# EAGLE design BusPirate-v5.0-SSOP (EAGLE 7.6.0)
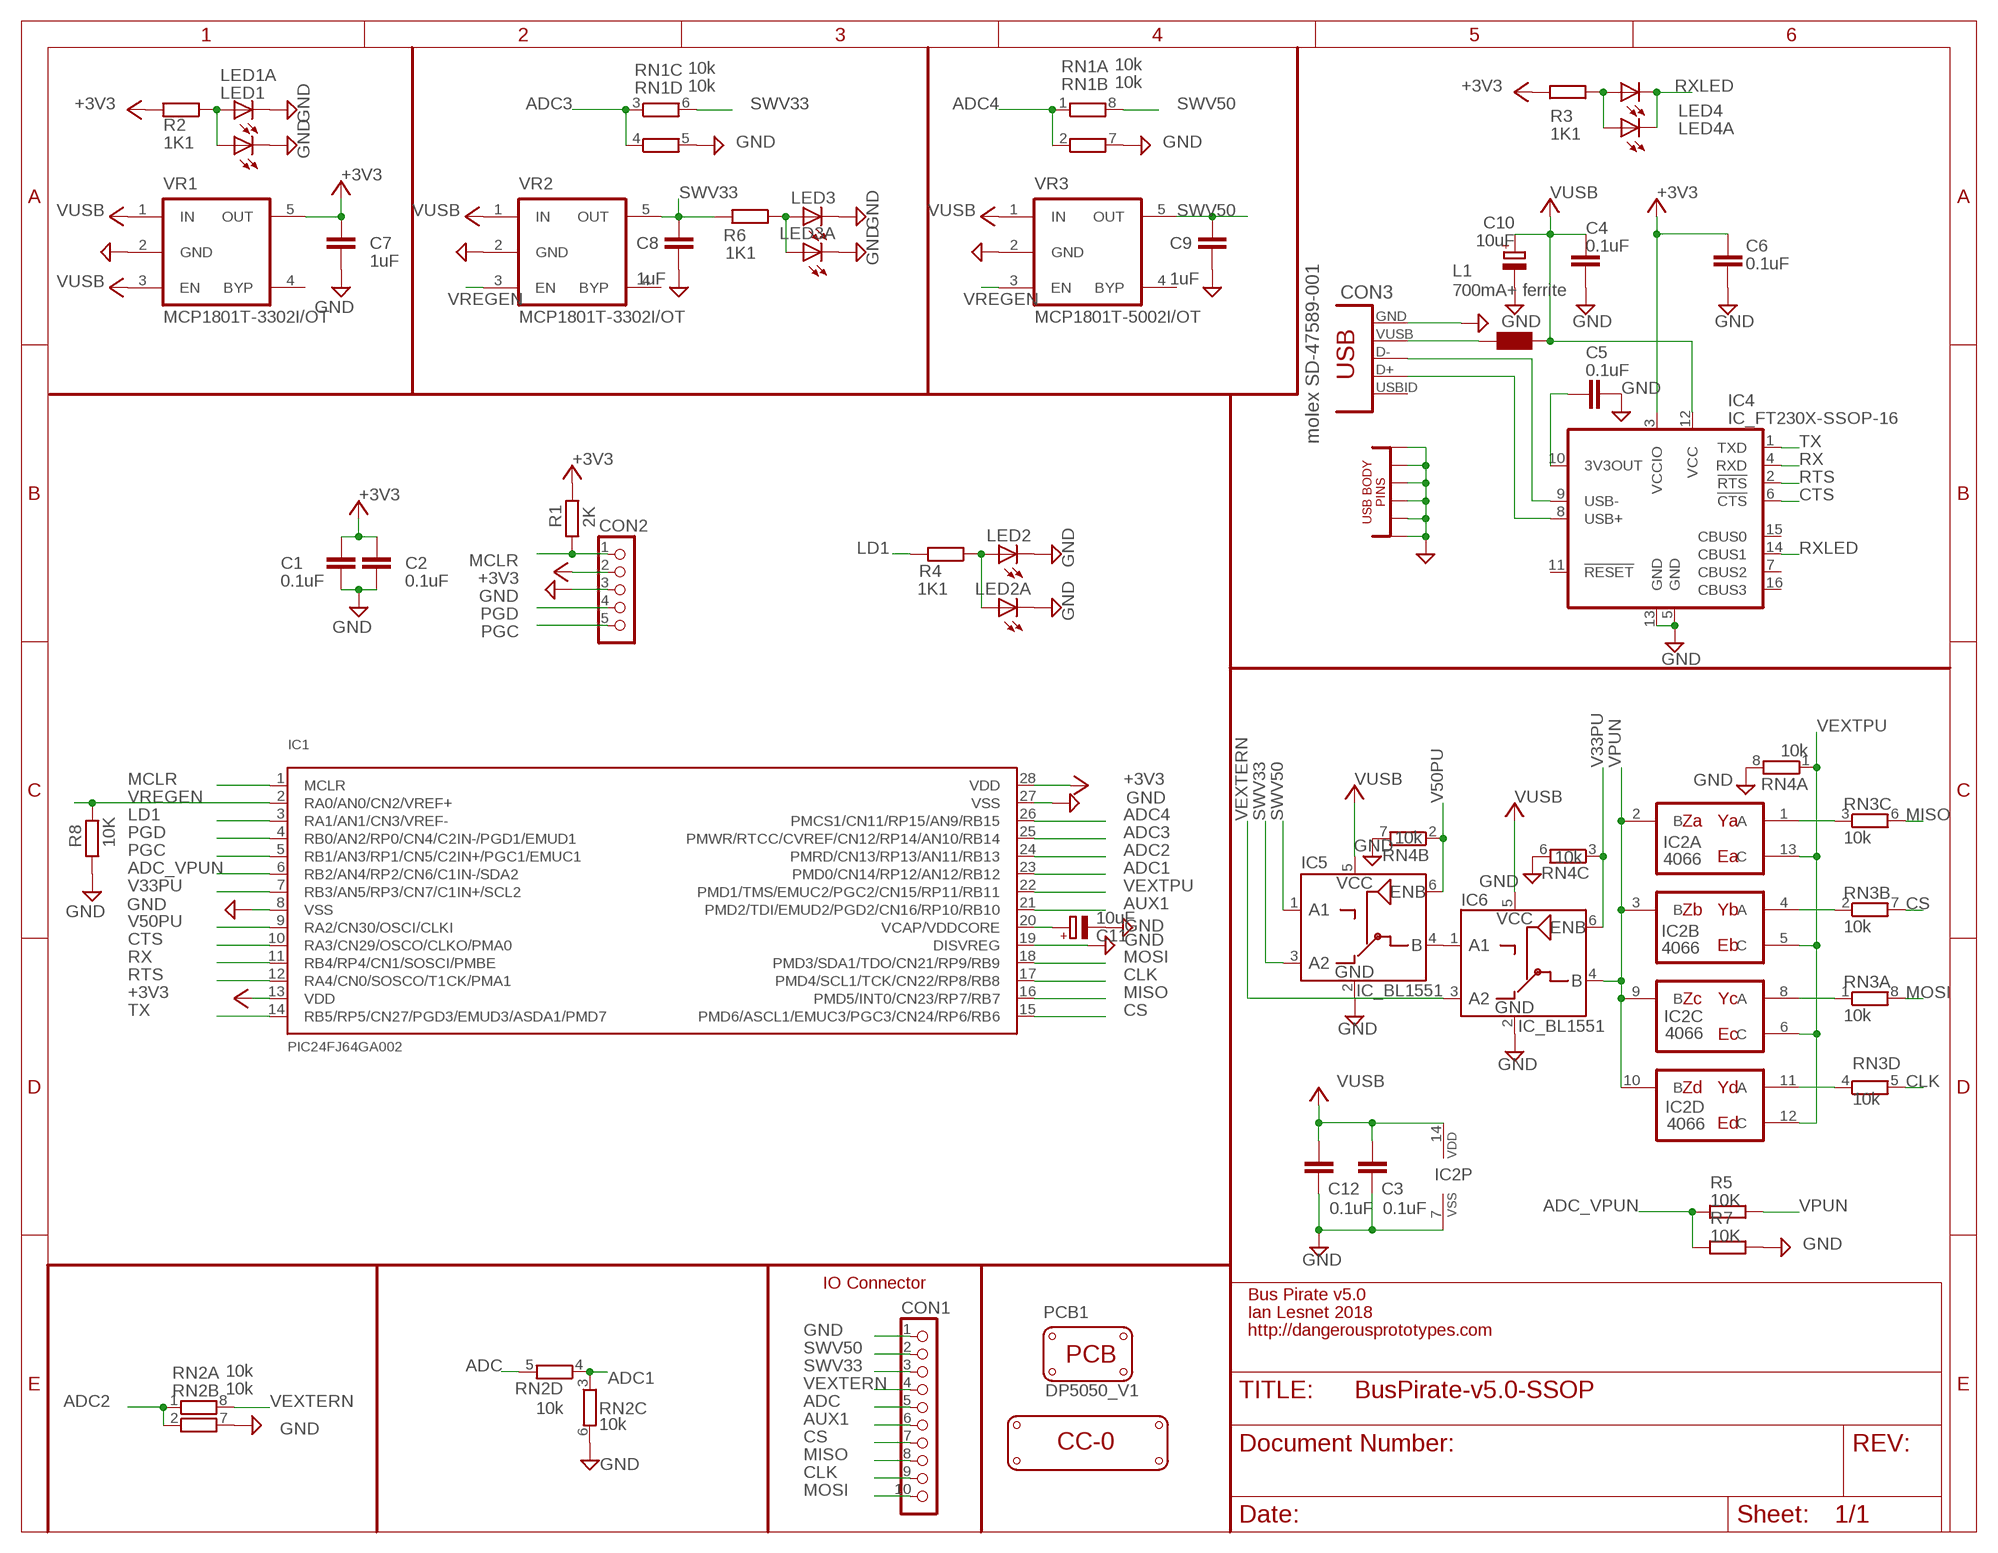
[diagram p0: schematic, sheet 1]

## Parts
C1  0.1uF  CAPC603  [C603]
C2  0.1uF  CAPC603  [C603]
C3  0.1uF  CAPC603  [C603]
C4  0.1uF  CAPC603  [C603]
C5  0.1uF  CAPC603  [C603]
C6  0.1uF  CAPC603  [C603]
C7  1uF  CAPC603  [C603]
C8  1uF  CAPC603  [C603]
C9  1uF  CAPC603  [C603]
C10  10uF  CPOL-EUSMCA  [SMC_A]
C11  10uF  CPOL-EUSMCA  [SMC_A]
C12  0.1uF  CAPC603  [C603]
CON1  CON_HEADER_1X10-RIGHT_ANGLED_PTH_SHROUDED  [M1X10_MALE_RIGHT_ANGLES_PTH_SHROUDED]
CON2  CON_HEADER_1X05-PTH  [M1X5]
CON3  molex SD-47589-001  CON-USB-F-MICRO-B-2  [CON_USB_MICRO-B-2-SD-47589-001]
IC1  PIC24FJ64GA002  [SSOP28]
IC2  4066  [TSSOP14]
IC4  IC_FT230X-SSOP-16  [SSOP-16-FTDI]
IC5  IC_BL1551  [SC-70-6]
IC6  IC_BL1551  [SC-70-6]
L1  700mA+ ferrite  WE-KIL_0805  [WE-KI_0805_B]
LED1  LED-0805  [LED-805]
LED1A  LED-0805  [LED-805]
LED2  LED-0805  [LED-805]
LED2A  LED-0805  [LED-805]
LED3  LED-0805  [LED-805]
LED3A  LED-0805  [LED-805]
LED4  LED-0805  [LED-805]
LED4A  LED-0805  [LED-805]
LOGO1  LOGO_CC-0  [LOGO_CC-0]
PCB1  PCB_DP_SQUARE-5X5  [DP5050_V1]
R1  2K  RESISTORR603  [R603]
R2  1K1  RESISTORR603  [R603]
R3  1K1  RESISTORR603  [R603]
R4  1K1  RESISTORR603  [R603]
R5  10K  RESISTORR603  [R603]
R6  1K1  RESISTORR603  [R603]
R7  10K  RESISTORR603  [R603]
R8  10K  RESISTORR603  [R603]
RN1  10k  RNETWORK  [RN8P-4R-CRA06S]
RN2  10k  RNETWORK  [RN8P-4R-CRA06S]
RN3  10k  RNETWORK  [RN8P-4R-CRA06S]
RN4  10k  RNETWORK  [RN8P-4R-CRA06S]
VR1  MCP1801T-3302I/OT  MIC5205  [SOT-23-5]
VR2  MCP1801T-3302I/OT  MIC5205  [SOT-23-5]
VR3  MCP1801T-5002I/OT  MIC5205  [SOT-23-5]

## Nets
$N26: CON3.P1(VUSB) L1.2
+3V3: C1.1 C2.1 C6.1 C7.1 CON2.2 IC1.13(VDD) IC1.28(VDD) IC4.3(VCCIO) R1.2 R2.2 R3.2 VR1.5(OUT) ; supply symbol labelled SUPPLY_+3V3
ADC: CON1.5 RN2.5
ADC1: IC1.23(PMD0/CN14/RP12/AN12/RB12) RN2.3 RN2.4
ADC2: IC1.24(PMRD/CN13/RP13/AN11/RB13) RN2.1 RN2.2
ADC3: IC1.25(PMWR/RTCC/CVREF/CN12/RP14/AN10/RB14) RN1.3 RN1.4
ADC4: IC1.26(PMCS1/CN11/RP15/AN9/RB15) RN1.1 RN1.2
ADC_VPUN: IC1.6(RB2/AN4/RP2/CN6/C1IN-/SDA2) R5.2 R7.2
AUX1: CON1.6 IC1.21(PMD2/TDI/EMUD2/PGD2/CN16/RP10/RB10)
CLK: CON1.9 IC1.17(PMD4/SCL1/TCK/CN22/RP8/RB8) RN3.5
CS: CON1.7 IC1.15(PMD6/ASCL1/EMUC3/PGC3/CN24/RP6/RB6) RN3.7
CTS: IC1.10(RA3/CN29/OSCO/CLKO/PMA0) IC4.6(!CTS)
GND: C1.2 C2.2 C3.2 C4.2 C5.2 C6.2 C7.2 C8.2 C9.2 C10.- C11.- C12.2 CON1.1 CON2.3 CON3.BODY@1 CON3.BODY@2 CON3.BODY@3 CON3.BODY@4 CON3.BODY@5 CON3.BODY@6 CON3.BODY@7 CON3.BODY@8 CON3.BODY@9 CON3.BODY@10 CON3.P5(GND) IC1.8(VSS) IC1.19(DISVREG) IC1.27(VSS) IC2.7(P:VSS) IC4.5(GND) IC4.13(GND) IC5.2(GND) IC6.2(GND) LED1.C LED1A.C LED2.C LED2A.C LED3.C LED3A.C R7.1 R8.1 RN1.5 RN1.7 RN2.6 RN2.7 RN4.6 RN4.7 RN4.8 VR1.2(GND) VR2.2(GND) VR3.2(GND)
LD1: IC1.3(RA1/AN1/CN3/VREF-) R4.2
MCLR: CON2.1 IC1.1(MCLR) R1.1
MISO: CON1.8 IC1.16(PMD5/INT0/CN23/RP7/RB7) RN3.6
MOSI: CON1.10 IC1.18(PMD3/SDA1/TDO/CN21/RP9/RB9) RN3.8
N$1: IC2.11(D:A) RN3.4
N$2: IC2.8(C:A) RN3.1
N$3: C11.+ IC1.20(VCAP/VDDCORE)
N$4: IC2.4(B:A) RN3.2
N$5: IC2.1(A:A) RN3.3
N$6: LED2.A LED2A.A R4.1
N$7: LED1.A LED1A.A R2.1
N$8: C5.1 IC4.10(3V3OUT)
N$12: IC5.4(B) IC6.1(A1)
N$13: LED4.A LED4A.A R3.1
N$15: CON3.P3(D+) IC4.8(USB+)
N$16: CON3.P2(D-) IC4.9(USB-)
N$18: LED3.A LED3A.A R6.1
PGC: CON2.5 IC1.5(RB1/AN3/RP1/CN5/C2IN+/PGC1/EMUC1)
PGD: CON2.4 IC1.4(RB0/AN2/RP0/CN4/C2IN-/PGD1/EMUD1)
RTS: IC1.12(RA4/CN0/SOSCO/T1CK/PMA1) IC4.2(!RTS)
RX: IC1.11(RB4/RP4/CN1/SOSCI/PMBE) IC4.4(RXD)
RXLED: IC4.14(CBUS1) LED4.C LED4A.C
SWV33: C8.1 CON1.3 IC5.3(A2) R6.2 RN1.6 VR2.5(OUT)
SWV50: C9.1 CON1.2 IC5.1(A1) RN1.8 VR3.5(OUT)
TX: IC1.14(RB5/RP5/CN27/PGD3/EMUD3/ASDA1/PMD7) IC4.1(TXD)
V33PU: IC1.7(RB3/AN5/RP3/CN7/C1IN+/SCL2) IC6.6(ENB) RN4.3
V50PU: IC1.9(RA2/CN30/OSCI/CLKI) IC5.6(ENB) RN4.2
VEXTERN: CON1.4 IC6.3(A2) RN2.8
VEXTPU: IC1.22(PMD1/TMS/EMUC2/PGC2/CN15/RP11/RB11) IC2.5(B:C) IC2.6(C:C) IC2.12(D:C) IC2.13(A:C) RN4.1
VPUN: IC2.2(A:B) IC2.3(B:B) IC2.9(C:B) IC2.10(D:B) IC6.4(B) R5.1
VREGEN: IC1.2(RA0/AN0/CN2/VREF+) R8.2 VR2.3(EN) VR3.3(EN)
VUSB: C3.1 C4.1 C10.+ C12.1 IC2.14(P:VDD) IC4.12(VCC) IC5.5(VCC) IC6.5(VCC) L1.1 VR1.1(IN) VR1.3(EN) VR2.1(IN) VR3.1(IN) ; supply symbol labelled SUPPLY_VUSB
Unconnected: CON3.P4(USBID) IC4.7(CBUS2) IC4.11(!RESET) IC4.15(CBUS0) IC4.16(CBUS3) RN4.4 RN4.5 VR1.4(BYP) VR2.4(BYP) VR3.4(BYP)

## Notes on the sheet
- Za | Ya
- Ea
- Zb | Yb
- Eb
- Zc | Yc
- Ec
- Zd | Yd
- Ed
- IO Connector
- Bus Pirate v5.0
- Ian Lesnet 2018
- http://dangerousprototypes.com

## Library data of the parts
C1-C9 C12 = dp_devices:CAP
C10 C11 = rcl:CPOL-EU: POLARIZED CAPACITOR, European symbol
CON1 = dp_devices.v6:CON_HEADER_1X10
CON2 = dp_devices.v6:CON_HEADER_1X05
CON3 = dp_devices.v6:CON-USB-F-MICRO-B-2: Micro USB based on molex SD-47589-001
IC1 = dp_devices:PIC24FJ64GA002: 16-bit General Purpose Flash Microcontroller
IC2 = 40xx:4066: Quad bilateral ANALOG SWITCH
IC4 = dp_devices.v6:IC_FT230X: BASIC USB to UART IC
IC5 IC6 = dp_devices.v6:IC_BL1551: BL1551 Low Voltage SPDT Analog Switch
L1 = wuerth-elektronik:WE-KIL: SMD Wire Wound Ceramic Inductor WE-KIL - Low profile - High Q values -- Bluetooth -- Wireless LAN -- RF oscillation circuit -- IF impedance matching
LED1 LED1A LED2 LED2A LED3 LED3A LED4 LED4A = dp_devices.v6:LED: Light Emitting Diode
LOGO1 = dp_devices:LOGO_CC-0
PCB1 = dp_devices.v6:PCB_DP_SQUARE: Dangerous Prototypes Standard Square PCB sizes; PCB_SIZE: DP5050_V1
R1-R8 = dp_devices:RESISTOR
RN1-RN4 = dp_devices:RNETWORK: 4 Resistor Array 0603
VR1-VR3 = dp_devices:MIC5205: 150ma Low-Noise LDO Regulator

## Board
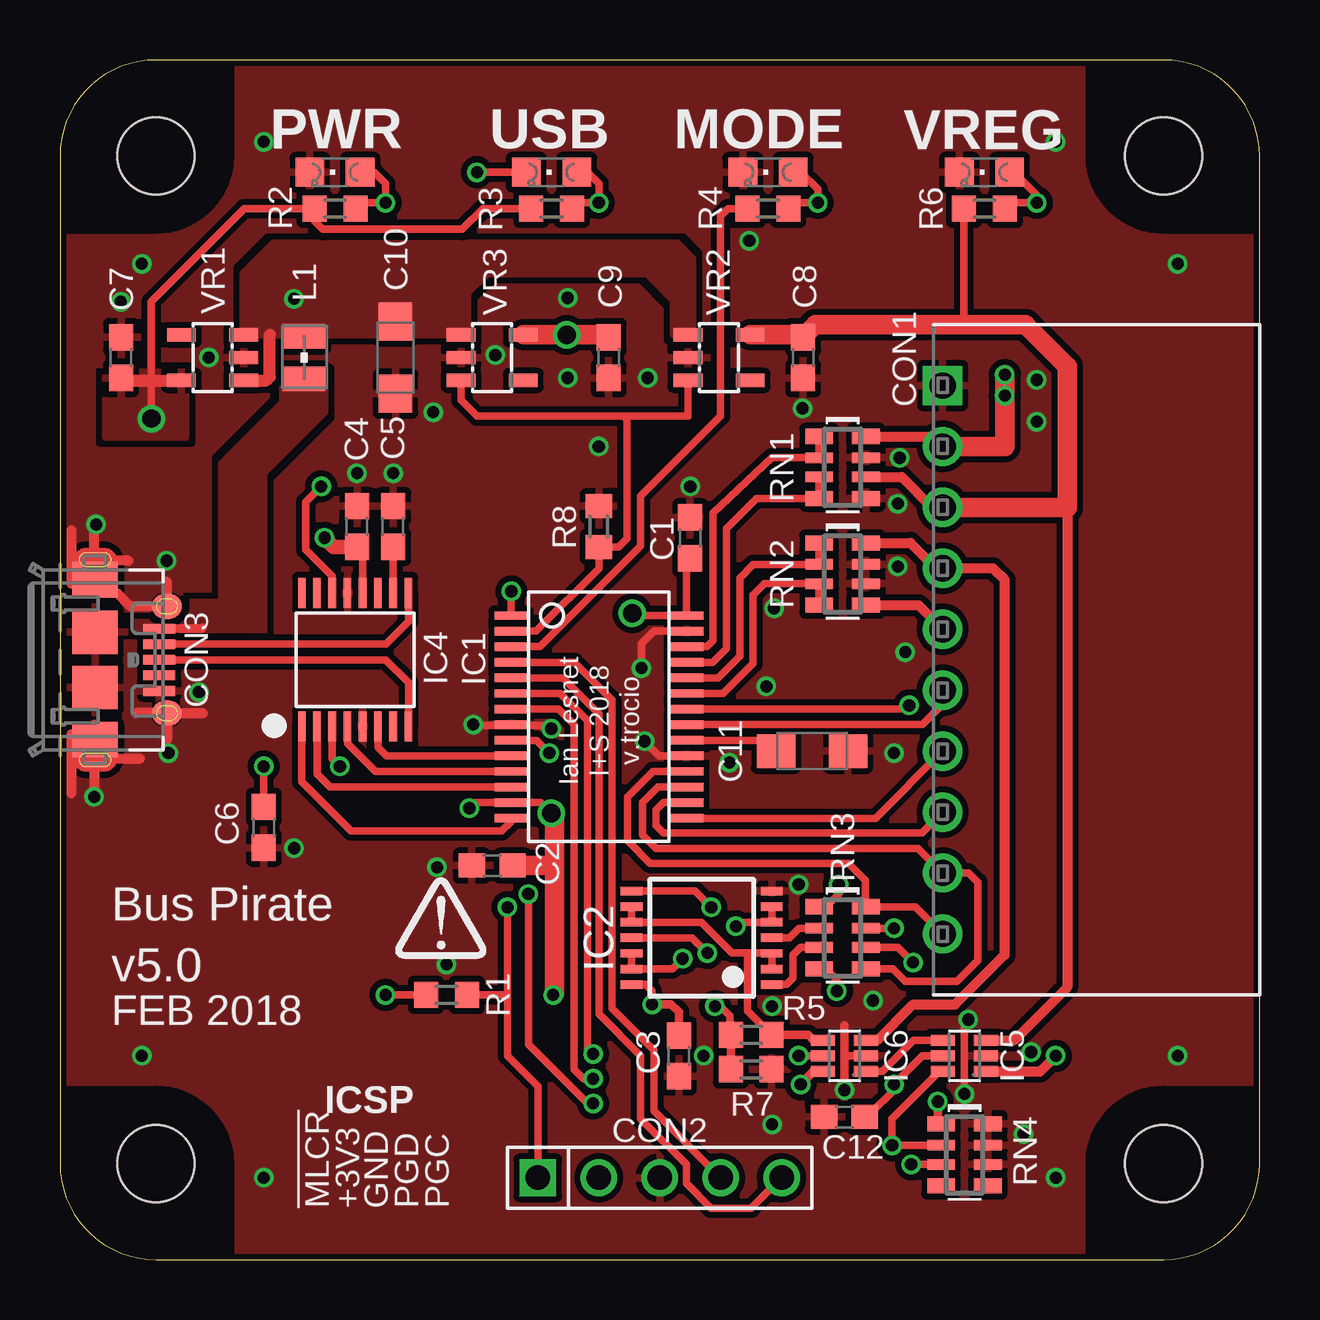
[diagram p1: board, top side]
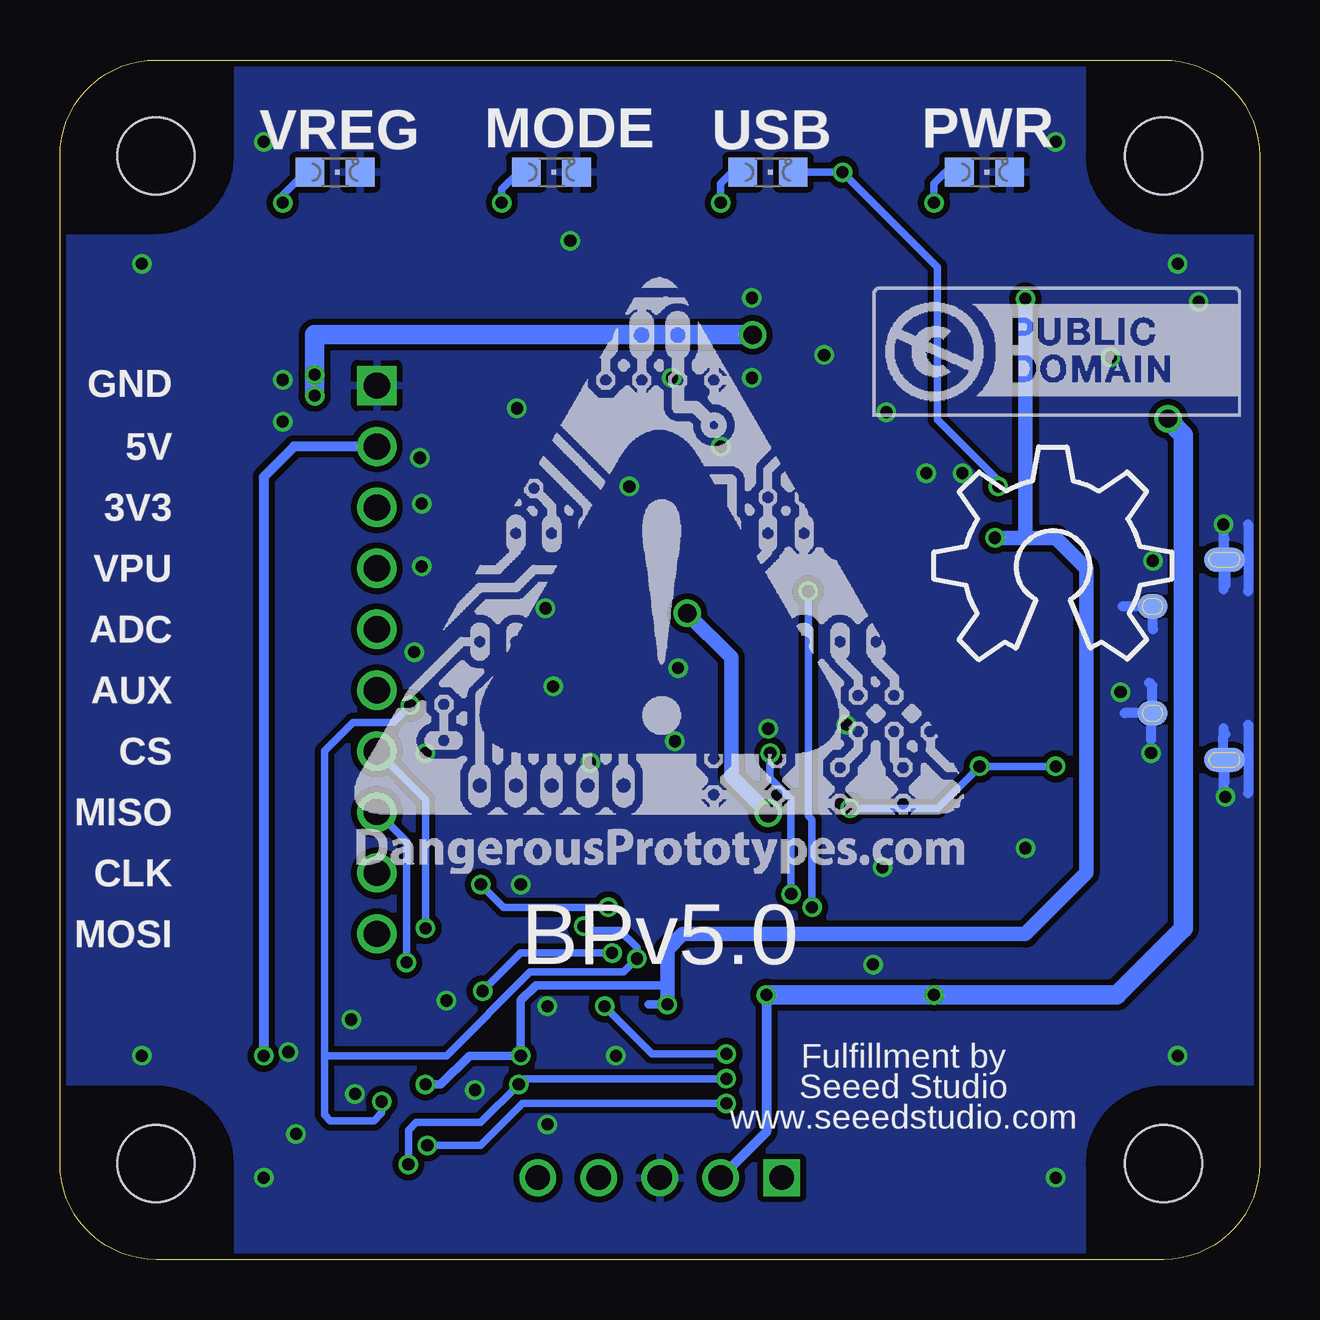
[diagram p2: board, bottom side, seen from below]

Size 50 x 50 mm. Coordinates in mm from the lower left corner, seen from the top.
Copper layers (1*16): Top 0.035mm / dielectric 1.5mm / Bottom 0.035mm
Design rules "dirt_cheap_dirty_boards.v1.1": minimum track width 6mil, minimum drill 12mil, track to track 6mil, track to pad 6mil, pad to pad 6mil, via to via 6mil, smd to smd 0mil, copper to edge 10mil, drill to drill 10mil, minimum pad ring 10mil, minimum via ring 6mil, stop-mask expansion 2mil, vias tented up to drill 25mil, thermal gap 10mil

### Footprints (pad centres in the part's own frame; a part is rotated, then mirrored left to right if it is on the bottom)
C603 = smd 1.1 x 1: 1 -0.85,0; 2 0.85,0
SMC_A = smd 1.6 x 1.4: + -1.5,0; - 1.5,0
M1X10_MALE_RIGHT_ANGLES_PTH_SHROUDED = drill 1.09 square: 1 -11.43,-6.415 | drill 1.09: 2 -8.89,-6.415; 3 -6.35,-6.415; 4 -3.81,-6.415; 5 -1.27,-6.415; 6 1.27,-6.415; 7 3.81,-6.415; 8 6.35,-6.415; 9 8.89,-6.415; 10 11.43,-6.415
M1X5 = drill 1.02 square: 1 -5.08,0 | drill 1.02: 2 -2.54,0; 3 0,0; 4 2.54,0; 5 5.08,0
CON_USB_MICRO-B-2-SD-47589-001 = smd 1.05 x 1.25: BODY@1 -2.225,3.35; BODY@3 2.225,3.35 | smd 1.05 x 1.25 bottom: BODY@2 -2.225,3.35; BODY@4 2.225,3.35 | smd 1.48 x 1.9: BODY@5 -3.338,0.35; BODY@9 3.338,0.35 | smd 1 x 1.7 bottom: BODY@6 -4.175,0.35; BODY@10 4.175,0.35 | smd 1.8 x 1.9: BODY@7 -1.15,0.35; BODY@8 1.15,0.35 | smd 0.4 x 1.35: P1 -1.3,3.025; P2 -0.65,3.025; P3 0,3.025; P4 0.65,3.025; P5 1.3,3.025
SSOP28 = smd 0.348 x 1.397: 1 -4.225,-3.656; 2 -3.575,-3.656; 3 -2.925,-3.656; 4 -2.275,-3.656; 5 -1.625,-3.656; 6 -0.975,-3.656; 7 -0.325,-3.656; 8 0.325,-3.656; 9 0.975,-3.656; 10 1.625,-3.656; 11 2.275,-3.656; 12 2.925,-3.656; 13 3.575,-3.656; 14 4.225,-3.656; 15 4.225,3.656; 16 3.575,3.656; 17 2.925,3.656; 18 2.275,3.656; 19 1.625,3.656; 20 0.975,3.656; 21 0.325,3.656; 22 -0.325,3.656; 23 -0.975,3.656; 24 -1.625,3.656; 25 -2.275,3.656; 26 -2.925,3.656; 27 -3.575,3.656; 28 -4.225,3.656
TSSOP14 = smd 0.35 x 0.9: 1 -1.95,-2.925; 2 -1.3,-2.925; 3 -0.65,-2.925; 4 0,-2.925; 5 0.65,-2.925; 6 1.3,-2.925; 7 1.95,-2.925; 8 1.95,2.925; 9 1.3,2.925; 10 0.65,2.925; 11 0,2.925; 12 -0.65,2.925; 13 -1.3,2.925; 14 -1.95,2.925
SSOP-16-FTDI = smd 0.32 x 1.26: 1 -2.223,-2.779; 2 -1.588,-2.779; 3 -0.953,-2.779; 4 -0.318,-2.779; 5 0.317,-2.779; 6 0.952,-2.779; 7 1.587,-2.779; 8 2.222,-2.779; 9 2.222,2.779; 10 1.587,2.779; 11 0.952,2.779; 12 0.317,2.779; 13 -0.318,2.779; 14 -0.953,2.779; 15 -1.588,2.779; 16 -2.223,2.779
SC-70-6 = smd 0.47 x 1: 1 -0.65,-0.9; 2 0,-0.9; 3 0.65,-0.9; 4 0.65,0.9; 5 0,0.9; 6 -0.65,0.9
WE-KI_0805_B = smd 1.02 x 1.78: 1 -0.89,0; 2 0.89,0
LED-805 = smd 1.2 x 1.2: A 0,-1.05; C 0,1.05
DP5050_V1 = hole 3.2: -21,-21; 21,-21; 21,21; -21,21
R603 = smd 1 x 1.1: 1 -0.85,0; 2 0.85,0
RN8P-4R-CRA06S = smd 0.63 x 1.15: 1 -1.295,-0.975; 4 1.295,-0.975; 5 1.295,0.975; 8 -1.295,0.975 | smd 0.44 x 1.15: 2 -0.4,-0.975; 3 0.4,-0.975; 6 0.4,0.975; 7 -0.4,0.975
SOT-23-5 = smd 0.55 x 1.2: 1 -0.95,-1.3; 2 0,-1.3; 3 0.95,-1.3; 4 0.95,1.3; 5 -0.95,1.3

### Placement (x,y rotation side)
C1  26.27,30.08 90 top
C2  18.02,16.42 180 top
C3  25.79,8.49 270 top
C4  12.38,30.56 90 top
C5  13.89,30.56 90 top
C6  8.49,18.02 270 top
C7  2.55,37.59 90 top
C8  30.97,37.59 270 top
C9  22.87,37.59 270 top
C10  13.98,37.59 270 top
C11  31.35,21.19 0 top
C12  32.7,5.95 180 top
CON1  43.2,25 270 top
CON2  25,3.41 0 top
CON3  1.11,25 270 top
IC1  22.46,22.62 270 top
IC2  26.75,13.41 90 top
IC4  12.3,25 0 top
IC5  37.7,8.49 90 top
IC6  32.7,8.49 90 top
L1  10.17,37.59 270 top
LED1  11.46,45.32 90 top
LED1A  11.46,45.32 270 bottom
LED2  29.51,45.32 90 top
LED2A  29.51,45.32 270 bottom
LED3  38.54,45.32 90 top
LED3A  38.54,45.32 270 bottom
LED4  20.49,45.32 90 top
LED4A  20.49,45.32 270 bottom
LOGO1  16.11,35.16 0 bottom
PCB1  25,25 0 top
R1  16.11,11.03 180 top
R2  11.46,43.8 180 top
R3  20.49,43.8 180 top
R4  29.51,43.8 180 top
R5  28.81,9.36 180 top
R6  38.54,43.8 180 top
R7  28.81,7.93 180 top
R8  22.46,30.56 270 top
RN1  32.62,33.02 270 top
RN2  32.62,28.57 270 top
RN3  32.62,13.41 270 top
RN4  37.7,4.36 270 top
U$1  [DP-LOGO]  13.97,12.54 0 top
U$2  [OSHW_8X350_NOTEXT]  13.57,25 0 bottom
U$3  [DP_LOGO_ART_1X1]  37.7,16.11 0 bottom
VR1  6.36,37.59 90 top
VR2  27.47,37.59 270 top
VR3  18.02,37.59 270 top

### Tracks (layer width: path | path; a pad name or v marks a point on that pad's centre or on a via)
$N26
  Top 0.356: CON3.P1 5.9,26.3 5.95,26.35
  pour Top (isolate 0.305, no thermals): 3.25,27.38 6.74,27.38 6.74,33.18 9.28,35.72 9.28,36.91 11.03,36.91 11.03,35.32 8.49,32.78 8.49,26.11 3.25,26.11
+3V3  (via drill 0.51, 0.76)
  Top 0.305: v17.06,18.81 17.3,19.04 IC1.13 20.03,19.04 v20.48,18.6 | C1.1 26.12,29.23 IC1.28 23.95,26.84 v23.86,26.94 | 3.81,36.64 3.81,39.92 7.68,43.8 R2.2 10.61,43.28 10.95,42.94 16.77,42.94 17.63,43.8 R3.2 | 3.81,36.64 VR1.5 | v8.49,20.55 C6.1 | IC4.3 11.35,20.87 v11.67,20.55 | v13.57,11.03 R1.2 | v3.81,35.05 3.81,36.64
  Top 0.406: 20.62,16.29 20.49,16.42
  Top 0.508: VR1.5 2.65,36.64 C7.1
  Top 0.61: 20.62,18.54 v20.48,18.6
  Top 0.813: 20.62,18.54 20.62,16.29 20.62,11.1 v20.55,11.03 | C2.1 20.49,16.42
  Bottom 0.305: v17.06,18.81 13.41,18.81 v11.67,20.55 v8.49,20.55
  Bottom 0.406: v20.55,11.03 20.55,5.32 CON2.2
  Bottom 0.61: v23.86,26.94 22.02,25.1 22.02,20.14 v20.48,18.6
  Bottom 0.813: v20.55,11.03 v13.57,11.03 5.95,11.03 3.17,13.81 3.17,34.37 3.81,35 v3.81,35.05
  pour Top: 1.9,36.99 5.24,36.99 5.24,34.29 1.9,34.29
ADC
  Top 0.406: RN2.5 35.78,27.28 CON1.5
ADC1
  Top 0.305: IC1.23 27.64,23.59 28.89,24.84 28.89,27.7 29.36,28.17 RN2.3 RN2.4
ADC2
  Top 0.305: RN2.1 RN2.2 28.89,28.97 28.33,28.41 28.33,25.16 27.42,24.24 IC1.24
ADC3
  Top 0.305: RN1.3 RN1.4 29.02,31.72 27.78,30.48 27.78,25.48 27.2,24.89 IC1.25
ADC4
  Top 0.305: RN1.1 RN1.2 29.69,33.42 27.22,31.11 27.22,25.79 26.97,25.54 IC1.26
ADC_VPUN  (via drill 0.51)
  Top 0.305: IC1.6 20.85,23.59 21.98,22.46 21.98,8.81 v22.22,8.57 | v27.3,10.55 27.54,10.55 27.94,10.16 27.94,9.39 R5.2
  Top 0.356: R7.2 R5.2
  Bottom 0.305: v22.22,8.57 25.32,8.57 v27.3,10.55
AUX1
  Top 0.305: IC1.21 35.95,22.29 36.79,23.14 CON1.6
CLK
  Top 0.305: IC1.17 24.93,19.69 24.29,19.05 24.29,17.7 24.84,17.14 35.76,17.14 CON1.9 37.86,16.11 38.26,15.71 38.26,12.46 37.38,11.59 35.24,11.59 34.71,12.12 RN3.5
CS  (via drill 0.51)
  Top 0.305: IC1.15 33.99,18.39 CON1.7 | v34.76,13.81 RN3.7
  Bottom 0.305: v34.76,13.81 34.76,19.16 CON1.7
CTS
  Top 0.305: IC1.10 13.61,20.99 13.25,21.35 IC4.6
GND  (via drill 0.51)
  Top 0.305: v24.24,24.65 24.24,25.67 24.77,26.19 IC1.27 25.99,26.2 | IC1.19 24.97,20.99 v24.37,21.6 | 17.66,22.26 20.45,22.26 | IC6.2 32.78,8.49 32.7,8.41 | v37.7,6.9 37.7,9.76
  Top 0.356: v32.7,7.06 32.7,8.41 32.7,9.76
  Top 0.406: 4.44,28.25 4.46,28.23 CON3.BODY@2 2.93,27.23 2.38,27.78 | CON3.BODY@4 5.95,22.78 | CON3.BODY@4 4.46,21.69 4.44,21.67 | CON3.BODY@4 3.17,22.78 | 2.85,29.13 0.47,29.13 | 1.43,27.86 1.43,30.56 | 0.47,30.4 0.47,28.18 | 1.43,22.3 v1.43,19.29 | 0.47,21.9 0.47,19.44 | 3.33,20.87 0.47,20.87
  Bottom 0.406: 5.71,27.22 5.71,27.23 CON3.BODY@2 4.46,26.29 4.44,26.27 | CON3.BODY@4 4.46,23.91 4.6,24.05 | 4.44,22.78 4.52,22.78 | 4.52,22.78 5.63,22.78 | 4.52,22.78 4.52,21.67 | 0.47,30.64 0.47,29.13 | 0.47,29.13 0.47,27.86 | 0.47,29.13 1.43,29.13 1.43,28.1 | 1.51,30.56 1.51,30.08 | 1.51,30.08 1.51,27.94 | CON3.BODY@6 1.46,30.04 1.51,30.08 | 1.51,22.14 1.51,21.83 | 1.51,20.87 1.51,19.84 | 1.51,19.84 1.51,19.13 | 0.47,22.3 0.47,20.87 | 0.47,20.87 0.47,19.44 | 1.51,20.87 0.47,20.87 | 1.51,20.87 1.51,21.83 | 1.51,21.83 1.43,21.9 | CON3.BODY@10 1.46,19.88 1.51,19.84
  other vias: 18.14,37.7 6.2,37.59 30.95,35.48 28.73,42.46 2.54,39.92 34.76,21.11 35.24,25.32 20.48,22.13 34.92,31.51 21.16,36.75 24.49,36.75 21.16,40.08 15.71,16.35 27.91,20.71 37.86,10 16.11,12.3 15.55,35.32 12.38,32.78 13.89,32.78 26.27,32.22 1.51,30.64 4.44,29.13 4.52,21.11 5.79,23.65 9.76,17.14 34.92,28.89 35,33.41 3.41,8.49 8.49,3.41 41.51,3.41 46.59,8.49 46.59,41.51 41.51,46.59 8.49,46.59 3.41,41.51 40.16,5.24 29.68,5.63 30.79,15.63 33.89,10.79 26.83,8.49 29.68,10.55 40.48,8.65 22.46,33.89 17.22,22.3 29.45,23.89 29.76,27.14 40.72,36.67 40.72,34.92
  pour Top (isolate 0.254, rank 6): 0.01,49.98 50.81,49.98 50.81,-0.82 0.01,-0.82
  pour Bottom (isolate 0.254): 0.01,49.98 50.81,49.98 50.81,-0.82 0.01,-0.82
LD1
  Top 0.305: IC1.3 20,25.54 24.21,29.75 24.21,31.83 27.54,35.16 27.54,43.49 27.85,43.8 R4.2
MCLR  (via drill 0.51)
  Top 0.305: v18.81,27.86 IC1.1 | R1.1 18.65,11.03 | v18.65,14.68 18.65,11.03 | 18.65,11.03 18.65,8.49 19.92,7.22 CON2.1
  Bottom 0.305: v18.81,27.86 18.81,18.49 18.65,18.33 v18.65,14.68
MISO  (via drill 0.51)
  Top 0.305: IC1.16 25.16,19.04 24.84,18.73 24.84,18.09 25.16,17.78 35.92,17.78 CON1.8 | RN3.6 34.93,13.01 v35.56,12.38
  Bottom 0.305: v35.56,12.38 35.56,17.42 CON1.8
MOSI
  Top 0.305: IC1.18 24.71,20.34 23.65,19.29 23.65,17.46 24.6,16.51 32.86,16.51 33.57,15.79 33.57,14.73 RN3.8 35.65,14.71 CON1.10
N$1  (via drill 0.51)
  Top 0.305: IC2.11 26.35,13.41 v26.98,12.78 | v32.38,11.19 32.38,11.67 31.93,12.12 RN3.4
  Bottom 0.305: v26.98,12.78 30.79,12.78 v32.38,11.19
N$2  (via drill 0.51)
  Top 0.305: IC2.8 26.46,15.36 v27.14,14.68 | v32.46,15.63 32.46,15.24 31.93,14.71 RN3.1
  Bottom 0.305: v27.14,14.68 31.51,14.68 v32.46,15.63
N$3
  Top 0.305: IC1.20 29.55,21.64 C11.+
N$4
  Top 0.305: IC2.4 30.4,13.41 30.8,13.81 RN3.2
N$5
  Top 0.305: IC2.1 30.27,11.46 30.56,11.74 30.56,12.7 30.87,13.01 RN3.3
N$6  (via drill 0.51)
  Top 0.305: LED2A.A 30.87,45.32 31.59,44.61 v31.59,44.05 30.61,44.05 R4.1
  Bottom 0.305: LED2A.A 30.87,45.32 31.59,44.61 v31.59,44.05
N$7  (via drill 0.51)
  Top 0.305: LED1A.A 13.09,45.32 13.57,44.84 v13.57,44.05 12.56,44.05 R2.1
  Bottom 0.305: LED1A.A 13.09,45.32 13.57,44.84 v13.57,44.05
N$8
  Top 0.305: IC4.10 C5.1 | C5.1
N$12
  Top 0.305: IC6.1 34.27,7.84 35.57,9.14 IC5.4
N$13  (via drill 0.51)
  Top 0.305: LED4A.A 21.98,45.32 22.46,44.84 v22.46,44.05 21.59,44.05 R3.1
  Bottom 0.305: LED4A.A 21.98,45.32 22.46,44.84 v22.46,44.05
N$15
  Top 0.305: IC4.8 14.52,24.05 13.57,25 CON3.P3
N$16
  Top 0.305: IC4.9 14.52,26.59 13.59,25.65 CON3.P2
N$18  (via drill 0.51)
  Top 0.305: LED3A.A 39.76,45.32 40.72,44.37 v40.72,44.05 39.64,44.05 R6.1
  Bottom 0.305: LED3A.A 39.76,45.32 40.72,44.37 v40.72,44.05
PGC
  Top 0.305: IC1.5 20.96,24.24 22.46,22.75 22.46,10.24 24.21,8.49 24.21,5.87 26.11,3.97 26.11,3.17 27.14,2.14 28.81,2.14 CON2.5
PGD
  Top 0.305: IC1.4 21.46,24.89 23.02,23.33 23.02,10.47 24.76,8.73 24.76,6.19 CON2.4
RTS
  Top 0.305: IC1.12 11.26,19.69 10.71,20.24 IC4.2
RX
  Top 0.305: IC1.11 13.15,20.34 11.98,21.51 IC4.4
RXLED  (via drill 0.51)
  Top 0.305: LED4A.C v17.38,45.32 | IC4.14 11.35,28.49 10.24,29.6 10.24,31.57 v10.89,32.22
  Bottom 0.305: LED4A.C v17.38,45.32 13.43,41.37 13.43,35.02 10.89,32.48 v10.89,32.22
SWV33
  Top 0.305: R6.2 37.69,38.98 37.7,38.97
  Top 0.406: 41.99,31.35 41.99,11.35 39.78,9.14 IC5.3 | RN1.6 35.08,32.62 36.35,31.35 CON1.3
  Top 0.508: 30.87,38.54 C8.1
  Top 0.813: VR2.5 30.87,38.54 | C8.1 31.5,38.97 37.7,38.97 40.24,38.97 41.99,37.22 41.99,31.35 CON1.3
SWV50  (via drill 0.51, 0.76)
  Top 0.406: IC5.1 40.86,7.84 v41.51,8.49 | RN1.8 36.37,34.31 CON1.2
  Top 0.508: 22.8,38.59 22.83,38.59 22.87,38.55
  Top 0.61: 22.8,38.59 C9.1
  Top 0.813: VR3.5 20.24,38.54 v21.13,38.55 22.87,38.55 | v39.38,36.88 v39.38,36.01 39.38,33.89 CON1.2
  Bottom 0.406: CON1.2 40.24,33.89 41.51,32.62 v41.51,8.49
  Bottom 0.813: v21.13,38.55 39.38,38.55 v39.38,36.01
TX
  Top 0.305: IC4.1 10.08,20.79 10.08,19.92 12.14,17.86 18.41,17.86 18.8,18.25 IC1.14
V33PU  (via drill 0.51)
  Top 0.305: IC1.7 20.79,22.94 21.43,22.3 21.43,7.93 21.83,7.54 v22.22,7.54 | RN4.3 v35.48,3.96 v35.48,3.97
  Top 0.356: IC6.6 31.41,7.84 v30.87,7.3
  Bottom 0.305: v22.22,7.54 30.64,7.54 v30.87,7.3 32.46,5.71 35.16,5.71 35.48,5.39 v35.48,3.97
V50PU  (via drill 0.51)
  Top 0.305: IC1.9 19.86,21.64 v20.4,21.11 | v19.52,15.24 19.52,8.97 21.98,6.51 v22.22,6.51 | RN4.2 34.77,4.76 v34.68,4.76 34.68,5.87 36.65,7.84 IC5.6
  Bottom 0.305: v20.4,21.11 20.4,20.08 19.52,19.21 v19.52,15.24 | v22.22,6.51 30.71,6.51 32.46,4.76 v34.68,4.76
VEXTERN
  Top 0.406: IC6.3 34.06,9.14 35.56,10.63 37.3,10.63 39.37,12.7 39.37,28.33 38.89,28.81 CON1.4 36.51,28.81 35.45,29.87 RN2.8
VEXTPU  (via drill 0.51)
  Top 0.305: IC2.6 IC2.5 28.35,14.06 v28.18,13.89 | IC2.12 IC2.13 25.53,12.11 v25.95,12.54 | IC1.22 35.25,22.94 v35.4,23.1
  Top 0.356: v36.59,6.59 36.59,5.79 RN4.1
  Bottom 0.305: v28.18,13.89 28.02,13.73 26.67,13.73 25.95,13.01 v25.95,12.54 26.51,11.98 30.4,11.98 33.89,8.49 38.97,8.49 | v35.4,23.1 36.11,22.38 37.78,22.38 38.97,21.19 38.97,8.49 | 38.97,8.49 38.97,6.03 38.73,5.79 36.91,5.79 36.59,6.11 v36.59,6.59
VPUN
  Top 0.305: IC2.2 IC2.3 29.66,12.78 28.57,12.78 | IC2.9 IC2.10 26.73,14.06 28.02,12.78 28.57,12.78 | 28.57,12.78 28.65,12.7 28.65,10.37 R5.1
  Top 0.356: IC6.4 31.41,9.14 31.19,9.36 R5.1
VREGEN
  Top 0.305: 16.71,35.83 17.38,35.16 23.49,35.16 | IC1.2 19.84,26.19 22.46,28.81 R8.2 23.28,29.71 23.63,30.06 23.63,35.02 23.49,35.16 | 16.71,35.83 VR3.3 | 16.71,35.83 | VR2.3 26.17,35.16 23.49,35.16
VUSB  (via drill 0.51)
  Top 0.305: IC4.12 12.62,29.47 C4.1 | IC2.14 24.41,11.46 24.68,11.19 v24.68,10.63 | IC6.5 v30.79,8.49 | IC5.5 35.95,8.49 v34.76,7.3 34.76,7.06 33.81,6.11 | 33.57,6.11 33.81,6.11 | C12.1 33.65,5.95 33.81,6.11
  Top 0.356: v24.68,10.63 25.48,10.63 25.79,10.32 C3.1 | C12.1 33.57,5.95
  Top 0.508: VR1.1 8.59,36.64 8.74,36.8 8.74,38.55 8.74,38.54
  Top 0.61: v11.03,30.08 11.4,29.71 C4.1
  Bottom 0.305: 23.49,13.73 23.65,13.57
  Bottom 0.356: 25.48,10.63 v24.68,10.63 24.68,11.43 30.16,11.43 30.79,10.79 v30.79,8.49 32.94,8.49 34.13,7.3 v34.76,7.3
  Bottom 0.61: v9.76,40.05 9.76,30.08 v11.03,30.08 8.49,30.08 7.22,28.81 7.22,16.11 9.76,13.57 23.65,13.57 24.05,13.57 24.68,12.94 v24.68,10.63
  pour Top (isolate 0.305, no thermals): 7.63,41.09 7.63,38.55 17,38.55 17,40.29 17.79,41.09 24.46,41.09 25.57,39.98 25.57,38.55 26.36,38.55 26.36,41.72 25.73,42.36 8.9,42.36

### Text on the board
tPlace: ICSP | !MLCR | +3V3 | GND | PGD | PGC
bPlace: GND | 5V | 3V3 | VPU | ADC | AUX | CS | MISO | CLK | MOSI
tNames: PWR | USB | MODE | VREG | Ian Lesnet | I+S 2018 | v.trocio | Bus Pirate | v5.0 | FEB 2018
bNames: PWR | USB | MODE | VREG | BPv5.0 | Fulfillment by | Seeed Studio | www.seeedstudio.com
Reference: I/O header | GND | 5V | 3V3 | VPU | ADC | AUX | CS | MISO | CLK | MOSI | Bus Pirate v5.0 | Ian Lesnet | CC-0 | FEB 2018 | http://dangerousprototypes.com | MCLR | +3.3V | GND | DATA | CLOCK | NC | ICSP Programming Header